# Altium schematic sheet Communications.SchDoc: Treetap 7C - USB & JTAG Interface
size A3; Author: Treetap Group; DrawnBy: Treetap Group; Revision: 1; SheetNumber: 4; SheetTotal: 7; PageSetup: Record=PageOptions|CenterHorizontal=True|CenterVertical=True|PrintScale=1.03|XCorrection=1.00|YCorrection=1.00|PrintKind=1|BorderSize=5000000|LeftOffset=0|BottomOffset=0|Orientation=2|PaperLength=1000|PaperWidth=1000|Scale=100|PaperSource=15|PrintQuality=600|MediaType=1|DitherType=10|PaperKind=A4|PrintScaleMode=1
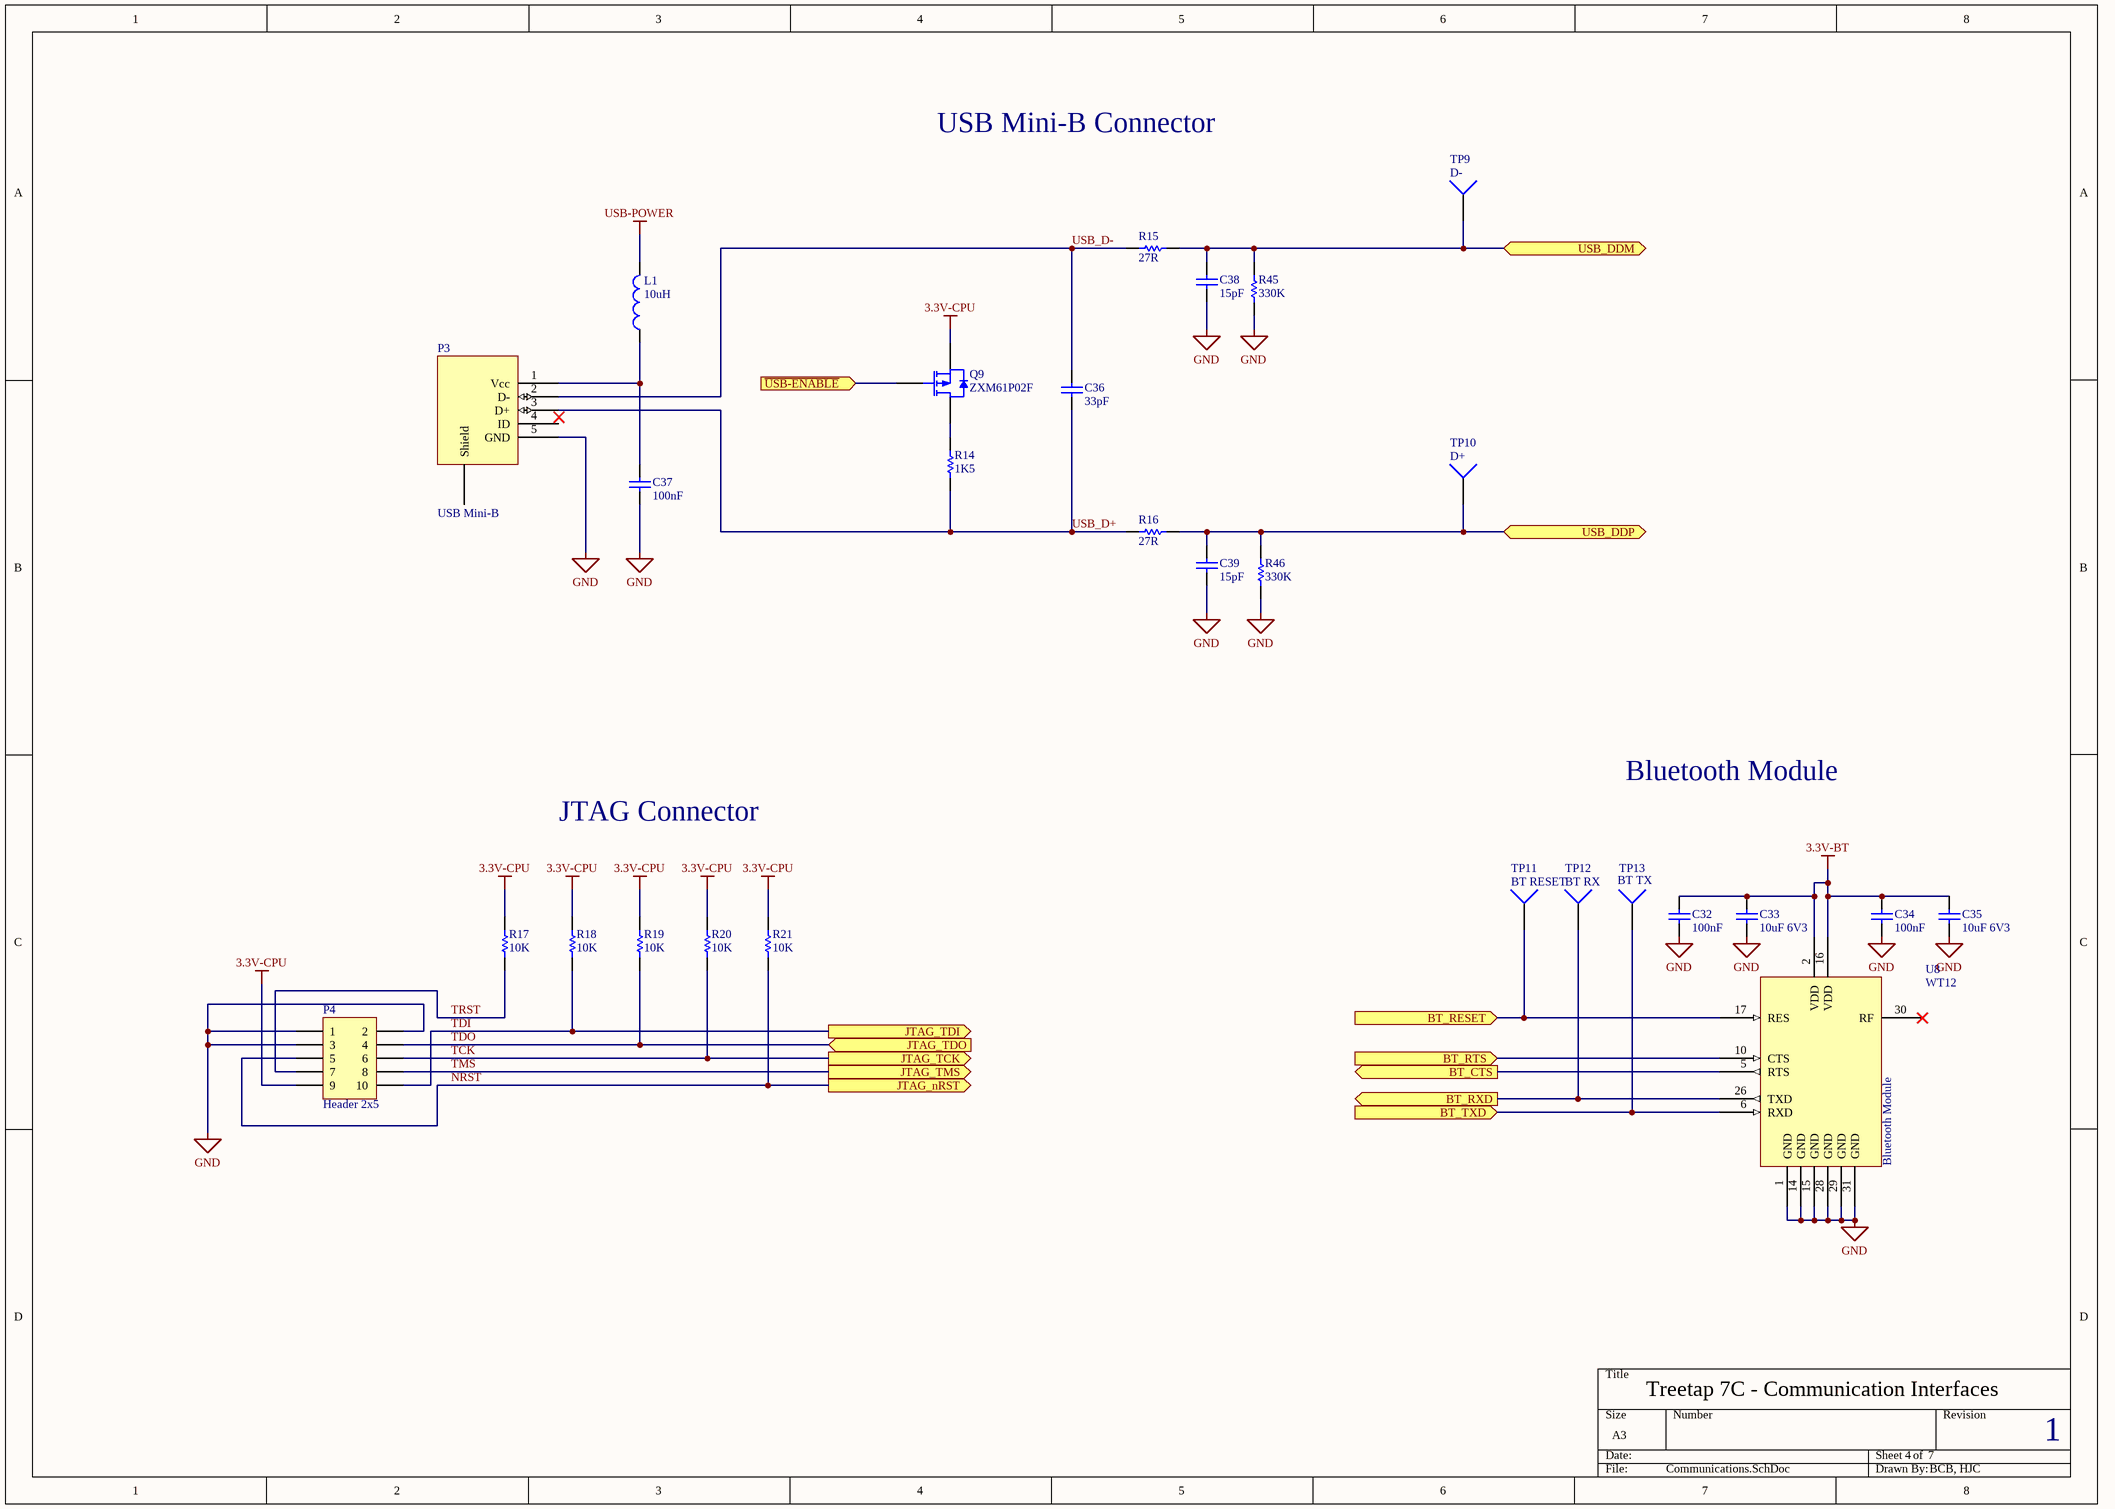
[diagram p0: Communications.SchDoc]

## Parts
C32  100nF  [CC0603]
C33  10uF 6V3  [CC0603]
C34  100nF  [CC0603]
C35  10uF 6V3  [CC0603]
C36  33pF  [CC0603]
C37  100nF  [CC0603]
C38  15pF  [CC0603]
C39  15pF  [CC0603]
L1  10uH  [0805]
P3  USB Mini-B  [USBminiB]
P4  Header 2x5  [HEADER 2x5]
Q9  ZXM61P02F  [SOT-23]
R14  1K5  [R0603]
R15  27R  [R0603]
R16  27R  [R0603]
R17  10K  [R0603]
R18  10K  [R0603]
R19  10K  [R0603]
R20  10K  [R0603]
R21  10K  [R0603]
R45  330K  [R0603]
R46  330K  [R0603]
TP9  D-  [SMTP_1]
TP10  D+  [SMTP_1]
TP11  BT RESET  [SMTP_1]
TP12  BT RX  [SMTP_1]
TP13  BT TX  [SMTP_1]
U8  WT12  [WT12_Bluetooth]

## Ports
BT_CTS (out), BT_RESET (in), BT_RTS (in), BT_RXD (out), BT_TXD (in), JTAG_nRST (out), JTAG_TCK (out), JTAG_TDI (out), JTAG_TDO (in), JTAG_TMS (out), USB_DDM (bidir), USB_DDP (bidir), ~{USB-ENABLE} (in)

## Nets
3.3V-BT: C32.2 C33.2 C34.2 C35.2 U8.2(VDD) U8.16(VDD)
3.3V-CPU: P4.9 Q9.2(S) R17.2 R18.2 R19.2 R20.2 R21.2
GND: C32.1 C33.1 C34.1 C35.1 C37.1 C38.1 C39.1 P3.5(GND) P4.1 P4.2 P4.3 R45.1 R46.1 U8.1(GND) U8.14(GND) U8.15(GND) U8.28(GND) U8.29(GND) U8.31(GND)
USB-POWER: L1.2
BT_CTS: U8.5(RTS) ; port BT_CTS
BT_RESET: TP11.1 U8.17(RES) ; port BT_RESET
BT_RTS: U8.10(CTS) ; port BT_RTS
BT_RXD: TP12.1 U8.26(TXD) ; port BT_RXD
BT_TXD: TP13.1 U8.6(RXD) ; port BT_TXD
NRST: P4.5 R21.1 ; port JTAG_nRST
TCK: P4.6 R20.1 ; port JTAG_TCK
TDI: P4.10 R18.1 ; port JTAG_TDI
TDO: P4.4 R19.1 ; port JTAG_TDO
TMS: P4.8 ; port JTAG_TMS
TRST: P4.7 R17.1
~{USB-ENABLE}: Q9.1(G) ; port ~{USB-ENABLE}
USB_D+: C36.1 P3.3(D+) R14.1 R16.1
USB_D-: C36.2 P3.2(D-) R15.1
USB_DDM: C38.2 R15.2 R45.2 TP9.1 ; port USB_DDM
USB_DDP: C39.2 R16.2 R46.2 TP10.1 ; port USB_DDP
NetC37_2: C37.2 L1.1 P3.1(Vcc)
NetQ9_3: Q9.3(D) R14.2

Not connected (* = marked no-connect by the designer): P3 4(ID) Shield; U8 30(RF)*

## Notes on the sheet
- USB Mini-B Connector
- Bluetooth Module
- JTAG Connector
- Treetap 7C - Communication Interfaces
- 4
- 7
- 1
- BCB, HJC
- (in symbol WT12_Bluetooth) Bluetooth Module

## Library data of the parts
C32 C34 C37 = 100nF_CC0603: 0603 Capacitor; Supplier_Component_Code: RC-P100; published: 28/03/2007 10:54:57 a.m.; Supplier_Name: Soanar Plus; price: 0.09; value: 100nF; Part Number: 100nF_CC0603; Component Kind: Standard; Component Type: Standard; Designator: 100nF_CC0603; Pin Count: 2
C33 C35 = 10uF_CC0603_6V3: 10uF 6.3V 0603 ceramic capacitor; Manufacturer: Multicomp; Part Number: MCCA000517; Supplier_Component_Code: 1759393; published: 8/06/2010; Supplier_Name: Farnell; price: 0.218; value: 10uF 6V3
C36 = 33pF_CC0603: 0603 Capacitor; Supplier_Component_Code: RC-P053; published: 28/03/2007 10:54:57 a.m.; Supplier_Name: Soanar Plus; price: 0.06; value: 33pF; Part Number: 33pF_CC0603; Component Kind: Standard; Component Type: Standard; Designator: 33pF_CC0603; Pin Count: 2
C38 C39 = 15pF_CC0603: 0603 Capacitor; Supplier_Component_Code: RC-P051; published: 28/03/2007 10:54:57 a.m.; Supplier_Name: Soanar Plus; price: 0.06; value: 15pF; Part Number: 15pF_CC0603; Component Kind: Standard; Component Type: Standard; Designator: 15pF_CC0603; Pin Count: 2
L1 = 10uH_ferrite: 10uH ferrite bead; Manufacturer: Tyco Electronics; Part Number: BMB2A0300AN1; Order multiple: 10; Pack of: 1; price: 0.21; Supplier_Component_Code: 1193418; Supplier_Name: Farnell; published: 07/01/2008; value: 10uH
P3 = USBminiB: USB mini B-type connector, surface mount with shield; Manufacturer: Molex; Part Number: 678038020; Order multiple: 1; value: USB Mini-B; Supplier_Name: Farnell; Supplier_Component_Code: 1355761; price: 0.61; Pack of: 1
P4 = HEADER 2x5: SMD Header, 2x5, boxed; Manufacturer: 3M; Part Number: N2510-6V0C-RB-WD; Order multiple: 1; Supplier_Name: Digikey; Supplier_Component_Code: MSH10KCT-ND; price: 2.46; Pack of: 1; value: Header 2x5
Q9 = ZXM61P02F: 20V P-channel enhancement mode MOSFET; Manufacturer: Zetex; Order multiple: 5; Pack of: 1; Supplier_Name: Farnell; Supplier_Component_Code: 9525297; price: 1.31; published: 7/12/2007; Part Number: ZXM61P02F; value: ZXM61P02F
R14 = 1K5_R0603: 0603 Resistor; ECE_Component_Code: 1K5_R0603; value: 1K5; Supplier_Component_Code: RS-S077; published: 12/03/2007 11:34:34 a.m.; Supplier_Name: Soanar Plus; price: 0.08; Part Number: 1K5_R0603; Component Kind: Standard; Component Type: Standard; Designator: 1K5_R0603; Pin Count: 2
R15 R16 = 27R_R0603: 0603 Resistor; ECE_Component_Code: 27R_R0603; value: 27R; Supplier_Component_Code: RS-S035; published: 12/03/2007 11:34:33 a.m.; Supplier_Name: Soanar Plus; price: 0.08; Part Number: 27R_R0603; Component Kind: Standard; Component Type: Standard; Designator: 27R_R0603; Pin Count: 2
R17-R21 = 10K_R0603: 0603 Resistor; ECE_Component_Code: 10K_R0603; value: 10K; Supplier_Component_Code: RS-S097; published: 12/03/2007 11:34:34 a.m.; Supplier_Name: Soanar Plus; price: 0.08; Part Number: 10K_R0603; Component Kind: Standard; Component Type: Standard; Designator: 10K_R0603; Pin Count: 2
R45 R46 = 330K_R0603: 0603 Resistor; ECE_Component_Code: 330K_R0603; value: 330K; Supplier_Component_Code: RS-S133; published: 12/03/2007 11:34:34 a.m.; Supplier_Name: Soanar Plus; price: 0.08; Part Number: 330K_R0603; Component Kind: Standard; Component Type: Standard; Designator: 330K_R0603; Pin Count: 2
TP9-TP13 = SMTestPoint: Test point hook (surface mount); Manufacturer: Harwin; Part Number: S1751-46; Order Multiple: 1; Pack of: 100; price: 40.01; published: 15/02/2010; Supplier_Name: Farnell; Supplier_Component_Code: 1022338; value: SMTestPoint
U8 = WT12_Bluetooth: Bluetooth Module Block; Manufacturer: Bluegiga; Part Number: WT12-A-AI; Pack of: 1; component_link1_url: http://www.semiconductorstore.com/cart/pc/viewPrd.asp?idproduct=5101; price: 71.61; Supplier_Name: Farnell; published: 15/02/2010; Supplier_Component_Code: 1656896; value: WT12; Order multiple: 1